# Altium schematic sheet Page#1.SchDoc
size 420 x 297 mm; Author: Алекс Зингер; Address1: Address1; Address2: Address2; Address3: Address3; Address4: Address4; DocumentNumber: АБВГ.123456.001 Э3; SheetNumber: 1; Scale: 1:1; DocumentType: Схема электрическая принципиальная; Mass: fghfh; FirstReferrence: АБВГ.123456.001; Rule: PcbType=ProtelPcb; Rule: PcbType=ProtelPcb; Rule: PcbType=ProtelPcb
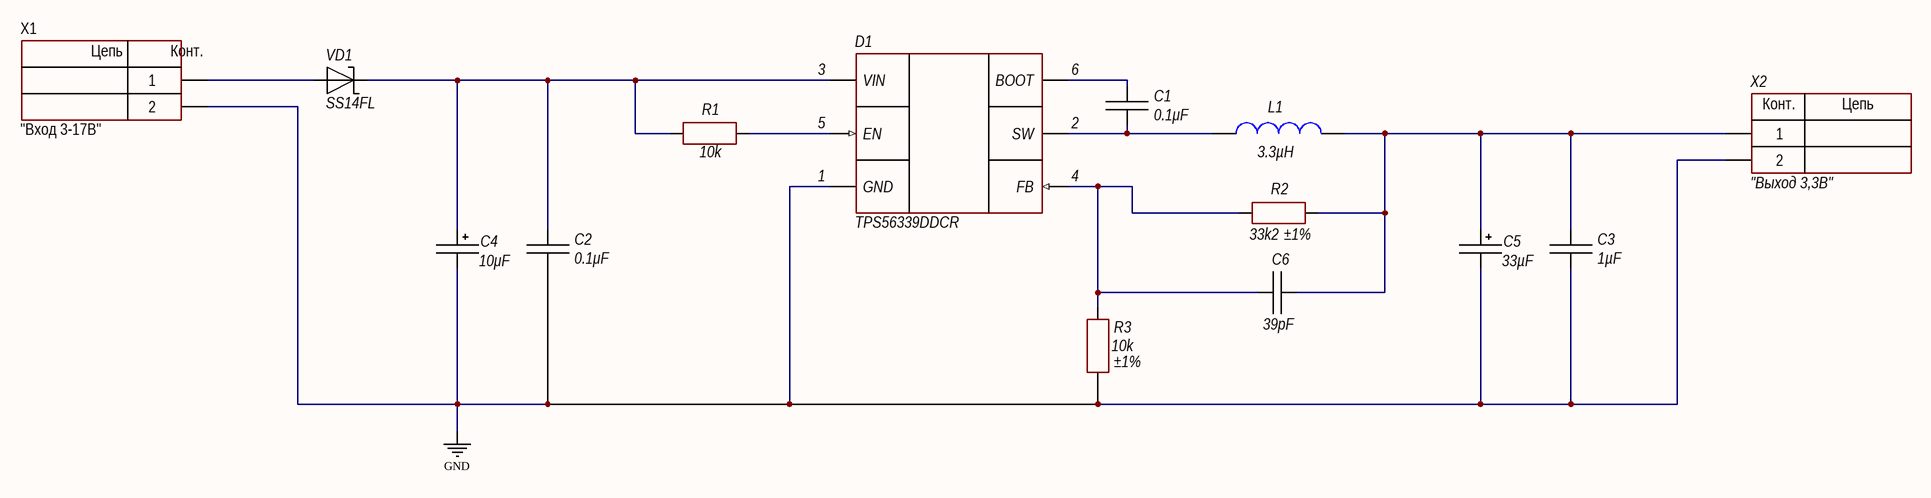
[diagram p0: Page#1.SchDoc]

## Parts
C1  value 0.1μF  [CAP: 0603]
C2  value 0.1μF  [CAP: 0603]
C3  value 1µF  [CAP: 0603]
C4  value 10μF  [CAP: TANTAL-A]
C5  value 33µF  [CAP: TANTAL-A]
C6  value 39pF  [CAP: 0603]
D1  (no value)  [SOT23-6]
L1  value 3.3µH  [IND: SDR0403]
R1  value 10k  [RES: 0603]
R2  value 33k2  Tolerance: ±1%  [RES: 0603]
R3  value 10k  Tolerance: ±1%  [RES: 0603]
VD1  SS14FL  [DIODE: SOD123F]
X1  CommentText: "Вход 3-17В"  [CON: 0533750210]
X2  "Выход 3,3В"  [CON: 0533750210]

## Nets
GND: C2.1 C3.1 C4.2 C5.2 D1.1(GND) R3.1 X1.2 X2.2
NetC1_1: C1.1 D1.2(SW) L1.2
NetC1_2: C1.2 D1.6(BOOT)
NetC2_2: C2.2 C4.1 D1.3(VIN) R1.2 VD1.2
NetC3_2: C3.2 C5.1 C6.1 L1.1 R2.2 X2.1
NetC6_2: C6.2 D1.4(FB) R2.1 R3.2
NetD1_5: D1.5(EN) R1.1
NetVD1_1: VD1.1 X1.1

## Notes on the sheet
- Перв. примен.
- Справ. №
- Подп. и дата
- Инв. № дубл.
- Взам. инв. №
- Разраб.
- Изм.
- Лист
- № докум.
- Подп.
- Дата
- Лит.
- Масса
- Масштаб
- Пров.
- Т.контр.
- Листов
- Инв. № подл.
- Утв.
- Н.контр.
- 2.106-A3
- Копировал
- Формат А3
- (in symbol Connector_6PCV-02) Конт.; Цепь
- (in symbol CWF-2R) Цепь; Конт.

## Library data of the parts
C1 C2 = Ceramic_0603: Manufacturer: Murata Electronics; PartNumber: GCJ188R71E104KA12D; ValueManufacturerPartNumber: Ceramic capacitor, 0.1μF, X7R, ±10%, 16V, 0603, -55...+125°C; TypeCapacitor: Ceramic capacitor; Tolerance: ±10%; TypeDielectric: X7R; Voltage: 16V; Package: 0603; HelpURL: https://www.digikey.com/product-detail/en/murata-electronics/GCJ188R71E104KA12D/490-16477-1-ND/7363459; Temperature: -55...+125°C
C3 = Ceramic_0603: Manufacturer: Murata Electronics; PartNumber: GRM188R61C105KA12D; ValueManufacturerPartNumber: Ceramic capacitor, 1µF, X5R, ±10%, 16V, 0603, -55°C ~ 85°C; TypeCapacitor: Ceramic capacitor; Tolerance: ±10%; TypeDielectric: X5R; Voltage: 16V; Package: 0603; HelpURL: https://www.digikey.com/products/en?keywords=490-10479-1-ND; Temperature: -55°C ~ 85°C
C4 = Tantal_A: Manufacturer: AVX Corporation; PartNumber: TCJA106M020R0150; ValueManufacturerPartNumber: Tantalum capacitor, 10μF, 20V, ±10%, 2Ohm, case A (3216), -55...+125°C; Impedance: 2Ohm; Tolerance: ±10%; TypeDielectric: X7R; TypeCapacitor: Tantalum capacitor; Voltage: 20V; Package: case A (3216); HelpURL: https://www.digikey.com/product-detail/en/avx-corporation/TCJA106M020R0150/478-9999-1-ND/6156151; Temperature: -55...+125°C
C5 = Tantal_A: Manufacturer: Vishay Sprague; PartNumber: T55A336M6R3C0200; ValueManufacturerPartNumber: Tantalum capacitor, 33µF, 6.3V, ±20%, 2Ohm, case A (3216), -55...+125°C; Impedance: 2Ohm; Tolerance: ±20%; TypeDielectric: X7R; TypeCapacitor: Tantalum capacitor; Voltage: 6.3V; Package: case A (3216); HelpURL: https://www.digikey.com/products/https://www.digikey.com/products/en?keywords=718-2005-1-NDen?keywords=718-2005-1-ND; Temperature: -55...+125°C
C6 = Ceramic_0603: Manufacturer: Murata Electronics; PartNumber: GRM1885C1H390JA01D; ValueManufacturerPartNumber: Ceramic capacitor, 39pF, C0G, NP0, ±5%, 50V, 0603, -55°C ~ 125°C; TypeCapacitor: Ceramic capacitor; Tolerance: ±5%; TypeDielectric: C0G, NP0; Voltage: 50V; Package: 0603; HelpURL: https://www.digikey.com/product-detail/en/murata-electronics/GRM1885C1H390JA01D/490-1417-1-ND/587622; Temperature: -55°C ~ 125°C
D1 = TPS56339DDCR: Sync buck converter; Manufacturer: Texas Instruments; ValueManufacturerPartNumber: DC/DC sync buck converter, input 4.5...24V, 500 kHz, output 0.8...16V, 3A, -40...+125°C, TSOT-23-6; VoltageInput: input 4.5...24V; Frequency: 500 kHz; CurrentOutput: 3A; VoltageOutput: output 0.8...16V; HelpURL: https://www.digikey.com/product-detail/en/texas-instruments/TPS56339DDCR/296-53568-1-ND/10273298; Package: TSOT-23-6; ComponentType: DC/DC sync buck converter; Temperature: -40...+125°C; PartNumber: TPS56339DDCR
L1 = Inductor_SDR0403: Manufacturer: Bourns; PartNumber: SDR0403-3R3ML; ValueManufacturerPartNumber: Wirewound, 3.3µH, ±20%, SDR0403, 3A, -40...+125°C; TypeInductor: Wirewound; MaxCurrent: 3A; Tolerance: ±20%; Package: SDR0403; HelpURL: https://www.digikey.com/product-detail/en/bourns-inc/SDR0403-3R3ML/SDR0403-3R3MLCT-ND/2127093; Temperature: -40...+125°C
R1 = Resistor_0603: Manufacturer: Yageo; PartNumber: RC0603FR-0710KL; ValueManufacturerPartNumber: Resistor film, 10k, ±1%, 0603, 0.1W, -55°C ~ 155°C; TypeResistor: Resistor film; Power: 0.1W; Tolerance: ±1%; Package: 0603; HelpURL: https://www.digikey.com/product-detail/en/yageo/RC0603FR-0710KL/311-10.0KHRCT-ND/729827; Temperature: -55°C ~ 155°C
R2 = Resistor_0603: Manufacturer: Yageo; PartNumber: RC0603FR-0733K2L; ValueManufacturerPartNumber: Thick Film, 33k2, ±1%, 0603, 0.1W, -55°C ~ 155°C; TypeResistor: Thick Film; Power: 0.1W; Package: 0603; HelpURL: https://www.digikey.com/product-detail/en/yageo/RC0603FR-0733K2L/311-33.2KHRCT-ND/730108; Temperature: -55°C ~ 155°C
R3 = Resistor_0603: Manufacturer: Yageo; PartNumber: RC0603FR-0710KL; ValueManufacturerPartNumber: Resistor film, 10k, ±1%, 0603, 0.1W, -55°C ~ 155°C; TypeResistor: Resistor film; Power: 0.1W; Package: 0603; HelpURL: https://www.digikey.com/product-detail/en/yageo/RC0603FR-0710KL/311-10.0KHRCT-ND/729827; Temperature: -55°C ~ 155°C
VD1 = Schottky_single: Manufacturer: ON Semiconductor; ValueManufacturerPartNumber: Schottky diode, 40V, 1A, 1V, 15pF, SOD-123F, -55°C ~ 125°C; TypeDiode: Schottky diode; Voltage: 40V; Current: 1A; VoltageDrop: 1V; RecoveryTime: 15pF; Package: SOD-123F; HelpURL: https://www.digikey.com/product-detail/en/on-semiconductor/SS14FL/SS14FLTR-ND/5305065; Temperature: -55°C ~ 125°C; PartNumber: SS14FL
X1 = CWF-2R: Manufacturer: Molex; ValueManufacturerPartNumber: Connector, 2pin, 2.50mm, 250V, 3A; PartNumber: 0533750210; TypeConnector: Connector; VoltageMax: 250V; Pitch: 2.50mm; CurrentMax: 3A; Multichannel: 2pin; HelpURL: https://www.digikey.com/products/en?keywords=0533750210
X2 = Connector_6PCV-02: Manufacturer: Molex; ValueManufacturerPartNumber: Connector, 2pin, 9.53mm, 300VAC, 25A; PartNumber: 0533750210; VoltageMax: 300VAC; Pitch: 9.53mm; CurrentMax: 25A; Multichannel: 2pin; CommentText: "Разъем"; HelpURL: https://www.digikey.com/products/en?keywords=0533750210; TypeConnector: Connector